# Altium schematic sheet 三川款阀控NB水表原理图_sch.schdoc: WX0.006.694DL
size A3; CompanyName: 浙江威星智能仪表股份有限公司; DocumentNumber: NB阀控水表; Revision: 1A; SheetNumber: 1; SheetTotal: 2; PageSetup: Record=PageOptions|CenterHorizontal=True|CenterVertical=True|PrintScale=0.90|XCorrection=1.00|YCorrection=1.00|PrintKind=0|BorderSize=5000000|LeftOffset=0|BottomOffset=0|Orientation=2|PaperLength=1000|PaperWidth=1000|Scale=100|PaperSource=7|PrintQuality=-3|MediaType=1|DitherType=10|PrintScaleMode=0|PaperKind=A3 (297 x 420 毫米)|PaperIndex=8
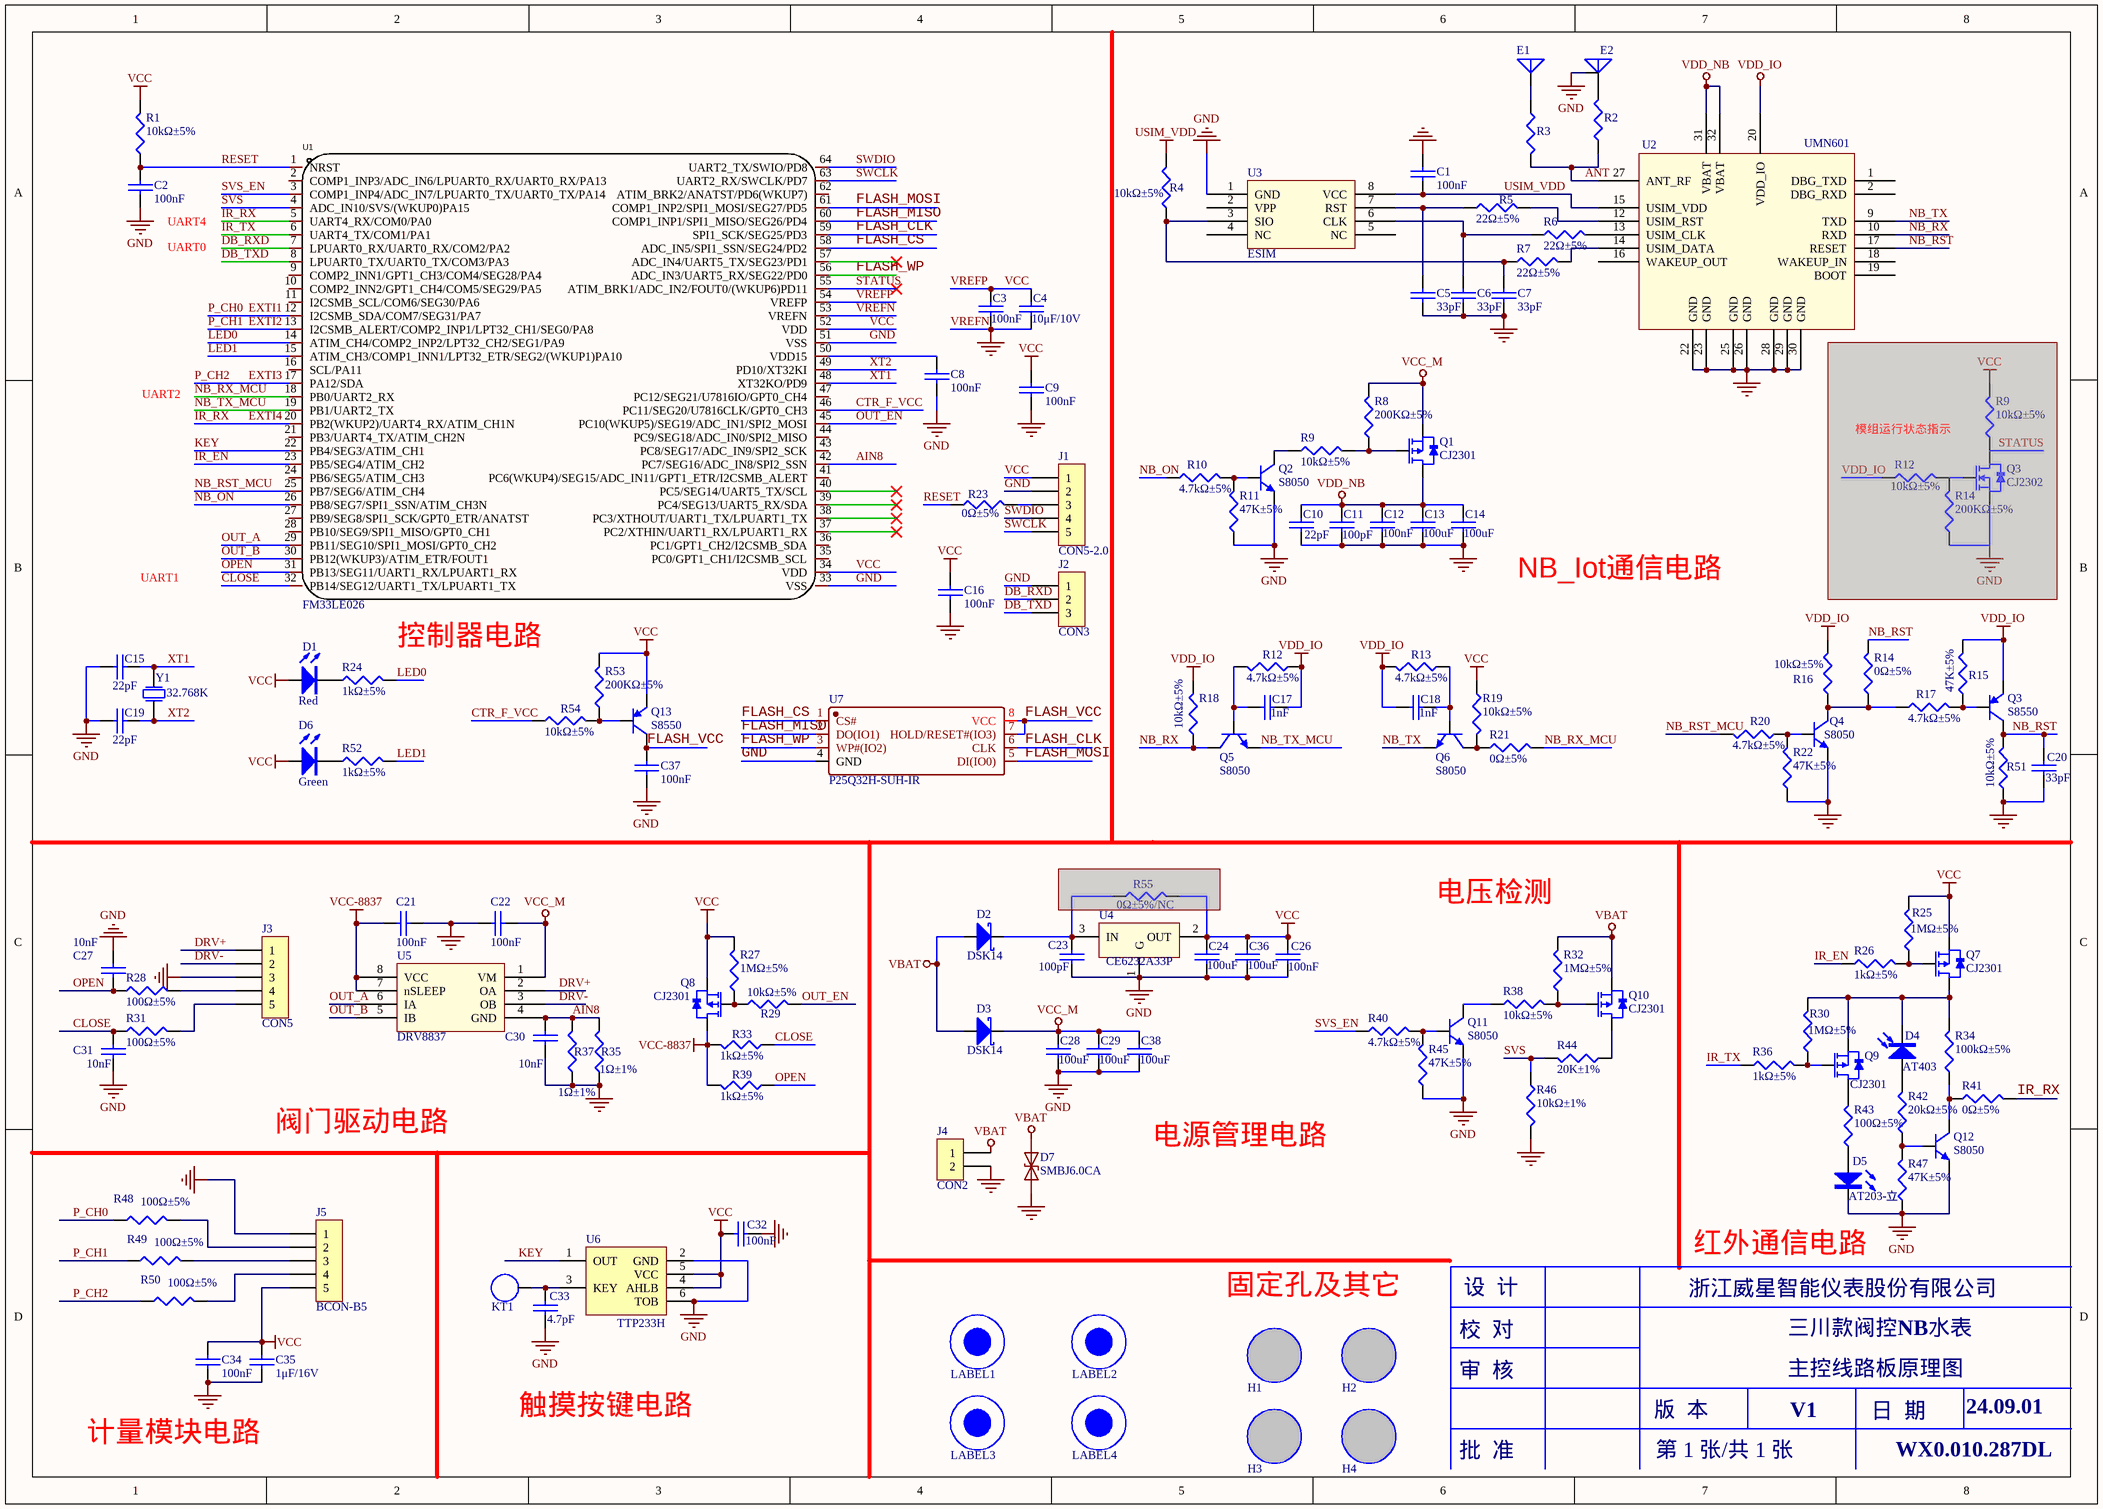
[diagram p0: 三川款阀控NB水表原理图_sch.schdoc]

## Parts
(Parts that share a designator on the sheet are numbered #1, #2 ... from top to bottom, then left to right.)
C1  100nF  [C0603]
C2  100nF  [C0603]
C3  100nF  [C0603]
C4  10μF/10V  [C0603]
C5  33pF  [C0603]
C6  33pF  [C0603]
C7  33pF  [C0603]
C8  100nF  [C0603]
C9  100nF  [C0603]
C10  22pF  [C0603]
C11  100pF  [C0603]
C12  100nF  [C0603]
C13  100uF  [C1206]
C14  100uF  [C1206]
C15  22pF  [C0603]
C16  100nF  [C0603]
C17  1nF  [C0603]
C18  1nF  [C0603]
C19  22pF  [C0603]
C20  33pF  [C0603]
C21  100nF  [C0603]
C22  100nF  [C0603]
C23  100pF  [C0603]
C24  100uF  [C1206]
C26  100nF  [C0603]
C27  10nF  [C0603]
C28  100uF  [C1206]
C29  100uF  [C1206]
C30  10nF  [C0603]
C31  10nF  [C0603]
C32  100nF  [C0603]
C33  4.7pF  [C0603]
C34  100nF  [C0603]
C35  1μF/16V  [C0603]
C36  100uF  [C1206]
C37  100nF  [C0603]
C38  100uF  [C1206]
D1  Red  [LED-0603]
D2  DSK14  [SOD-123]
D3  DSK14  [SOD-123]
D4  AT403  [LED-3]
D5  AT203-立  [LED-3]
D6  Green  [LED-0603]
D7  SMBJ6.0CA  [TVS-SMB]
E1  (no value)  [ANT-1]
E2  ANTENNA_3  [ANT-3]  (value not drawn)
H1  (no value)  [HOLE-2.5]  (no BOM)
H2  (no value)  [HOLE-2.5]  (no BOM)
H3  (no value)  [HOLE-2.5]  (no BOM)
H4  (no value)  [HOLE-2.5]  (no BOM)
J1  CON5-2.0  [J_DIP_2.0_1*05_H]  (no BOM)
J2  CON3  [SIP-3]  (no BOM)
J3  CON5  [SIP-5]  (no BOM)
J4  CON2  [SIP-2]  (no BOM)
J5  BCON-B5  [BCON-B5]  (no BOM)
KT1  Touch  [TOUCH-1]  (value not drawn)
LABEL1  (no value)  [MARK]  (no BOM)
LABEL2  (no value)  [MARK]  (no BOM)
LABEL3  (no value)  [MARK]  (no BOM)
LABEL4  (no value)  [MARK]  (no BOM)
Q1  CJ2301  [SOT-23]
Q2  S8050  [SOT-23]
Q3#1  CJ2302  [SOT-23]  (masked out: inside a compile mask, not in the netlist)
Q3#2  S8550  [SOT-23]
Q4  S8050  [SOT-23]
Q5  S8050  [SOT-23]
Q6  S8050  [SOT-23]
Q7  CJ2301  [SOT-23]
Q8  CJ2301  [SOT-23]
Q9  CJ2301  [SOT-23]
Q10  CJ2301  [SOT-23]
Q11  S8050  [SOT-23]
Q12  S8050  [SOT-23]
Q13  S8550  [SOT-23]
R1  10kΩ±5%  [R0603]
R2  0Ω±5%  [R0603]  (value not drawn)
R3  0Ω±5%  [R0603]  (value not drawn)
R4  10kΩ±5%  [R0603]
R5  22Ω±5%  [R0603]
R6  22Ω±5%  [R0603]
R7  22Ω±5%  [R0603]
R8  200KΩ±5%  [R0603]
R9#1  10kΩ±5%  [R0603]
R9#2  10kΩ±5%  [R0603]  (masked out: inside a compile mask, not in the netlist)
R10  4.7kΩ±5%  [R0603]
R11  47K±5%  [R0603]
R12#1  10kΩ±5%  [R0603]  (masked out: inside a compile mask, not in the netlist)
R12#2  4.7kΩ±5%  [R0603]
R13  4.7kΩ±5%  [R0603]
R14#1  200KΩ±5%  [R0603]  (masked out: inside a compile mask, not in the netlist)
R14#2  0Ω±5%  [R0603]
R15  47K±5%  [R0603]
R16  10kΩ±5%  [R0603]
R17  4.7kΩ±5%  [R0603]
R18  10kΩ±5%  [R0603]
R19  10kΩ±5%  [R0603]
R20  4.7kΩ±5%  [R0603]
R21  0Ω±5%  [R0603]
R22  47K±5%  [R0603]
R23  0Ω±5%  [R0603]
R24  1kΩ±5%  [R0603]
R25  1MΩ±5%  [R0603]
R26  1kΩ±5%  [R0603]
R27  1MΩ±5%  [R0603]
R28  100Ω±5%  [R0603]
R29  10kΩ±5%  [R0603]
R30  1MΩ±5%  [R0603]
R31  100Ω±5%  [R0603]
R32  1MΩ±5%  [R0603]
R33  1kΩ±5%  [R0603]
R34  100kΩ±5%  [R0603]
R35  1Ω±1%  [R1206]
R36  1kΩ±5%  [R0603]
R37  1Ω±1%  [R1206]
R38  10kΩ±5%  [R0603]
R39  1kΩ±5%  [R0603]
R40  4.7kΩ±5%  [R0603]
R41  0Ω±5%  [R0603]
R42  20kΩ±5%  [R0603]
R43  100Ω±5%  [R0603]
R44  20K±1%  [R0603]
R45  47K±5%  [R0603]
R46  10kΩ±1%  [R0603]
R47  47K±5%  [R0603]
R48  100Ω±5%  [R0603]
R49  100Ω±5%  [R0603]
R50  100Ω±5%  [R0603]
R51  10kΩ±5%  [R0603]
R52  1kΩ±5%  [R0603]
R53  200KΩ±5%  [R0603]
R54  10kΩ±5%  [R0603]
R55  0Ω±5%/NC  [R0603]  (masked out: inside a compile mask, not in the netlist)
U1  FM33LE026  [LQFP-64_L10.0-W10.0-P0.50-LS12.0-BL]
U2  UMN601  [MB26-Y0B]
U3  ESIM  [MFF2]
U4  CE6232A33P  [SOT89]
U5  DRV8837  [WSON-8]
U6  TTP233H  [SOT-23-6]
U7  P25Q32H-SUH-IR  [SOIC-8]
Y1  32.768K  [Y3215]

## Nets
GND: C1.1 C2.1 C3.1 C4.1 C5.1 C6.1 C7.2 C8.1 C9.1 C10.1 C11.1 C12.1 C13.1 C14.1 C15.1 C16.1 C19.1 C20.1 C21.1 C22.2 C23.1 C24.1 C26.1 C27.2 C28.1 C29.1 C30.1 C31.1 C32.2 C33.1 C34.1 C35.1 C36.1 C37.1 C38.1 D5.2(K) D7.2(A1) E2.2 J1.2 J2.1 J3.3 J4.2 J5.1 Q2.2(E) Q4.2(E) Q11.2(E) Q12.2(E) R11.1 R22.1 R35.1 R37.1 R45.1 R46.2 R47.1 R51.1 U1.33(VSS) U1.51(VSS) U1.53(VREFN) U2.22(GND) U2.23(GND) U2.25(GND) U2.26(GND) U2.28(GND) U2.29(GND) U2.30(GND) U3.1(GND) U4.1(G) U5.0(GND) U6.2(GND) U6.6(TOB) U7.4(GND)  [also labelled VREFN]
USIM_VDD: C1.2 R4.2 U2.15(USIM_VDD) U3.8(VCC)
VBAT: D2.1(A) D3.1(A) D7.1(A2) J4.1 Q10.2(S) R32.2
VCC: C3.2 C4.2 C9.2 C16.2 C24.2 C26.2 C32.1 C34.2 C35.2 C36.2 D1.1(A) D6.1(A) J1.1 J5.5 Q7.2(S) Q8.2(S) Q13.2(E) R1.2 R19.1 R25.2 R27.2 R53.2 U1.34(VDD) U1.52(VDD) U1.54(VREFP) U4.2(OUT) U6.4(AHLB) U6.5(VCC)  [also labelled VREFP]
VCC-8837: C21.2 Q8.3(D) R33.2 R39.2 U5.7(nSLEEP) U5.8(VCC)
VCC_M: C22.1 C28.2 C29.2 C38.2 D3.2(K) Q1.2(S) R8.2 U5.1(VM)
VDD_IO: C17.2 C18.1 Q3#2.2(E) R12#2.1 R13.2 R15.2 R16.2 R18.2 U2.20(VDD_IO)
VDD_NB: C10.2 C11.2 C12.2 C13.2 C14.2 Q1.3(D) U2.31(VBAT) U2.32(VBAT)
AIN8: C30.2 R35.2 R37.2 U1.42(PC7/SEG16/ADC_IN8/SPI2_SSN) U5.4(GND)
ANT: R2.1 R3.2 U2.27(ANT_RF)
CLOSE: C31.2 R31.1 R33.1 U1.32(PB14/SEG12/UART1_TX/LPUART1_TX)
CTR_F_VCC: R54.1 U1.46(PC11/SEG20/U7816CLK/GPT0_CH3)
DB_RXD: J2.2 U1.7(LPUART0_RX/UART0_RX/COM2/PA2)
DB_TXD: J2.3 U1.8(LPUART0_TX/UART0_TX/COM3/PA3)
DRV+: J3.1 U5.2(OA)
DRV-: J3.2 U5.3(OB)
EXTI1: R48.1 U1.12(I2CSMB_SDA/COM7/SEG31/PA7)  [also labelled P_CH0]
EXTI2: R49.1 U1.13(I2CSMB_ALERT/COMP2_INP1/LPT32_CH1/SEG0/PA8)  [also labelled P_CH1]
EXTI3: R50.1 U1.17(PA12/SDA)  [also labelled P_CH2]
EXTI4: R41.2 U1.5(UART4_RX/COM0/PA0) U1.20(PB2(WKUP2)/UART4_RX/ATIM_CH1N)  [also labelled IR_RX]
FLASH_CLK: U1.59(SPI1_SCK/SEG25/PD3) U7.6(CLK)
FLASH_CS: U1.58(ADC_IN5/SPI1_SSN/SEG24/PD2) U7.1(CS#)
FLASH_MISO: U1.60(COMP1_INP1/SPI1_MISO/SEG26/PD4) U7.2(DO(IO1))
FLASH_MOSI: U1.61(COMP1_INP2/SPI1_MOSI/SEG27/PD5) U7.5(DI(IO0))
FLASH_VCC: C37.2 Q13.3(C) U7.7(HOLD/RESET#(IO3)) U7.8(VCC)
FLASH_WP: U1.56(ADC_IN3/UART5_RX/SEG22/PD0) U7.3(WP#(IO2))
IR_EN: R26.1 U1.23(PB5/SEG4/ATIM_CH2)
IR_TX: R36.1 U1.6(UART4_TX/COM1/PA1)
KEY: U1.22(PB4/SEG3/ATIM_CH1) U6.1(OUT)
LED0: R24.2 U1.14(ATIM_CH4/COMP2_INP2/LPT32_CH2/SEG1/PA9)
LED1: R52.2 U1.15(ATIM_CH3/COMP1_INN1/LPT32_ETR/SEG2/(WKUP1)PA10)
NB_ON: R10.1 U1.26(PB8/SEG7/SPI1_SSN/ATIM_CH3N)
NB_RST: C20.2 Q3#2.3(C) R14#2.2 R51.2 U2.17(RESET)
NB_RST_MCU: R20.2 U1.25(PB7/SEG6/ATIM_CH4)
NB_RX: Q5.3(C) R18.1 U2.10(RXD)
NB_RX_MCU: R21.2 U1.18(PB0/UART2_RX)
NB_TX: Q6.2(E) U2.9(TXD)
NB_TX_MCU: Q5.2(E) U1.19(PB1/UART2_TX)
OPEN: C27.1 R28.1 R39.1 U1.31(PB13/SEG11/UART1_RX/LPUART1_RX)
OUT_A: U1.29(PB11/SEG10/SPI1_MOSI/GPT0_CH2) U5.6(IA)
OUT_B: U1.30(PB12(WKUP3)/ATIM_ETR/FOUT1) U5.5(IB)
OUT_EN: R29.2 U1.45(PC10(WKUP5)/SEG19/ADC_IN1/SPI2_MOSI)
RESET: C2.2 R1.1 R23.1 U1.1(NRST)
STATUS: U1.55(ATIM_BRK1/ADC_IN2/FOUT0/(WKUP6)PD11)
SVS: R44.2 R46.1 U1.4(ADC_IN10/SVS/(WKUP0)PA15)
SVS_EN: R40.1 U1.3(COMP1_INP4/ADC_IN7/LPUART0_TX/UART0_TX/PA14)
SWCLK: J1.5 U1.63(UART2_RX/SWCLK/PD7)
SWDIO: J1.4 U1.64(UART2_TX/SWIO/PD8)
XT1: C15.2 U1.48(XT32KO/PD9) Y1.2(P2)
XT2: C19.2 U1.49(PD10/XT32KI) Y1.1(P1)
NetC5_2: C5.2 R5.1 U3.7(RST)
NetC6_2: C6.2 R6.1 U3.6(CLK)
NetC7_1: C7.1 R4.1 R7.1 U3.3(SIO)
NetC8_2: C8.2 U1.50(VDD15)
NetC17_1: C17.1 Q5.1(B) R12#2.2
NetC18_2: C18.2 Q6.1(B) R13.1
NetC23_2: C23.2 D2.2(K) U4.3(IN)
NetC33_2: C33.2 KT1.1 U6.3(KEY)
NetD1_2: D1.2(K) R24.1
NetD4_1: D4.1(A) R42.2
NetD4_2: D4.2(K) Q7.3(D) Q9.2(S) R30.2 R34.2
NetD5_1: D5.1(A) R43.1
NetD6_2: D6.2(K) R52.1
NetE1_1: E1.1(A) R3.1
NetE2_1: E2.1(A) R2.2
NetJ1_3: J1.3 R23.2
NetJ3_4: J3.4 R28.2
NetJ3_5: J3.5 R31.2
NetJ5_2: J5.2 R48.2
NetJ5_3: J5.3 R49.2
NetJ5_4: J5.4 R50.2
NetQ1_1: Q1.1(G) R8.1 R9#1.2
NetQ2_1: Q2.1(B) R10.2 R11.2
NetQ2_3: Q2.3(C) R9#1.1
NetQ3#2_1: Q3#2.1(B) R15.1 R17.2
NetQ4_1: Q4.1(B) R20.1 R22.2
NetQ4_3: Q4.3(C) R14#2.1 R16.1 R17.1
NetQ6_3: Q6.3(C) R19.2 R21.1
NetQ7_1: Q7.1(G) R25.1 R26.2
NetQ8_1: Q8.1(G) R27.1 R29.1
NetQ9_1: Q9.1(G) R30.1 R36.2
NetQ9_3: Q9.3(D) R43.2
NetQ10_1: Q10.1(G) R32.1 R38.2
NetQ10_3: Q10.3(D) R44.1
NetQ11_1: Q11.1(B) R40.2 R45.2
NetQ11_3: Q11.3(C) R38.1
NetQ12_1: Q12.1(B) R42.1 R47.2
NetQ12_3: Q12.3(C) R34.1 R41.1
NetQ13_1: Q13.1(B) R53.1 R54.2
NetR5_2: R5.2 U2.12(USIM_RST)
NetR6_2: R6.2 U2.13(USIM_CLK)
NetR7_2: R7.2 U2.14(USIM_DATA)

Not connected (* = marked no-connect by the designer): U1 2(COMP1_INP3/ADC_IN6/LPUART0_RX/UART0_RX/PA13) 9(COMP2_INN1/GPT1_CH3/COM4/SEG28/PA4) 10(COMP2_INN2/GPT1_CH4/COM5/SEG29/PA5) 11(I2CSMB_SCL/COM6/SEG30/PA6) 16(SCL/PA11) 21(PB3/UART4_TX/ATIM_CH2N) 24(PB6/SEG5/ATIM_CH3) 27(PB9/SEG8/SPI1_SCK/GPT0_ETR/ANATST) 28(PB10/SEG9/SPI1_MISO/GPT0_CH1) 35(PC0/GPT1_CH1/I2CSMB_SCL) 36(PC1/GPT1_CH2/I2CSMB_SDA) 37(PC2/XTHIN/UART1_RX/LPUART1_RX)* 38(PC3/XTHOUT/UART1_TX/LPUART1_TX)* 39(PC4/SEG13/UART5_RX/SDA)* 40(PC5/SEG14/UART5_TX/SCL)* 41(PC6(WKUP4)/SEG15/ADC_IN11/GPT1_ETR/I2CSMB_ALERT) 43(PC8/SEG17/ADC_IN9/SPI2_SCK) 44(PC9/SEG18/ADC_IN0/SPI2_MISO) 47(PC12/SEG21/U7816IO/GPT0_CH4) 57(ADC_IN4/UART5_TX/SEG23/PD1)* 62(ATIM_BRK2/ANATST/PD6(WKUP7)); U2 1(DBG_TXD) 2(DBG_RXD) 16(WAKEUP_OUT) 18(WAKEUP_IN) 19(BOOT); U3 2(VPP) 4(NC) 5(NC)

## Notes on the sheet
- (near C2) UART4
- UART0
- UART2
- (near R12#1) 模组运行状态指示
- UART1
- NB_Iot通信电路
- 控制器电路
- 电压检测
- 阀门驱动电路
- 电源管理电路
- 红外通信电路
- 固定孔及其它
- 设  计
- 浙江威星智能仪表股份有限公司
- 审  核
- 校  对
- 三川款阀控NB水表
- 主控线路板原理图
- 计量模块电路
- 触摸按键电路
- 批  准
- 版  本
- 第 1 张/共 1 张
- V1
- 日  期
- WX0.010.287DL
- 24.09.01
- 校 对
- 设 计
- 审 核
- PROJECT :
- 标准化
- 工 艺
- Size
- A3
- Docment Number
- Revision
- File
- Date
- Sheet
- of

## Library data of the parts
C1-C3 C8 C9 C12 C16 C21 C22 C26 C32 C34 C37 = 1: 贴片电容,100nF±10%/50V,X7R,国巨; Part Number: 101020103-0021; Manufacturer P/N: CC0603KRX7R9BB104; ID: 1; Part Name: 贴片电容; Manufacturer: 国巨
C4 = 8: 贴片电容,10μF±10%/10V,X7R,村田; Part Number: 101020103-0026; Manufacturer P/N: GRM188R61A106KE47D; ID: 8; Part Name: 贴片电容; Manufacturer: 村田
C5-C7 C20 = 4: 贴片电容,33pF±10%/50V,NP0,国巨; Part Number: 101020103-0027; Manufacturer P/N: CC0603KRNPO9BN33; ID: 4; Part Name: 贴片电容; Manufacturer: 国巨
C10 C15 C19 = 3: 贴片电容,22pF±5%/50V,NP0,国巨; Part Number: 101020103-0009; Manufacturer P/N: CC0603JRNPO9BN22; ID: 3; Part Name: 贴片电容; Manufacturer: 国巨
C11 C23 = 9: 贴片电容,100pF±10%/50V,NP0,国巨; Part Number: 101020103-0010; Manufacturer P/N: CC0603JRNPO9BN101; ID: 9; Part Name: 贴片电容; Manufacturer: 国巨
C13 C14 C24 C28 C29 C36 C38 = 16: 贴片电容,100uF±20%/6.3V,X5R,村田; Part Number: 101020101-0020; Manufacturer P/N: GRM31CR60J107ME39L; ID: 16; Part Name: 贴片电容; Manufacturer: 村田
C17 C18 = 6: 贴片电容,1nF±10%/50V,X7R,国巨; Part Number: 101020103-0022; Manufacturer P/N: CC0603KRX7R9BB102; ID: 6; Part Name: 贴片电容; Manufacturer: 国巨
C27 C30 C31 = 5: 贴片电容,10nF±10%/50V,X7R,国巨; Part Number: 101020103-0007; Manufacturer P/N: CC0603KRX7R9BB103; ID: 5; Part Name: 贴片电容; Manufacturer: 国巨
C33 = 18: 贴片电容,4.7pF±0.25pF/50V,NPO,国巨; Part Number: 101020103-0040; Manufacturer P/N: CC0603CRNP09BN4R7; ID: 18; Part Name: 贴片电容; Manufacturer: 国巨
C35 = 2: 贴片电容,1μF±10%/16V,X7R,国巨; Part Number: 101020103-0003; Manufacturer P/N: CC0603KRX7R7BB105; ID: 2; Part Name: 贴片电容; Manufacturer: 国巨
D1 = 3: 发光二极管,红色,0603,光宝; Part Number: 101040102-0006; ID: 3; Part Name: 发光二极管; Manufacturer: 光宝
D2 D3 = 8: DSK14,SOD-123FL,1 A,40 V,28 V,台湾强茂集团苏州群鑫电子,DSK14; Part Number: 101040101-0043; Part Name: 贴片二极管; ID: 8; Manufacturer: 台湾强茂集团苏州群鑫电子
D4 = 6: 红外接收头，插件，红光，AT403_PD_01; Part Number: 101040102-0011; Part Name: 红外接收管; Manufacturer: 品观; ID: 6; SMD/DIP: DIP
D5 = 5: 红外发射头，插件，红光，AT203; Part Number: 101040102-0010; Part Name: 红外发射管; Manufacturer: 品观; ID: 5
D6 = 5: 发光二极管,绿色,亿光，19-217/GHC-YR1S2/3T; Part Number: 101040102-0018; Part Name: 贴片发光二极管; Manufacturer: 亿光; ID: 5; Manufacturer P/N: 19-217/GHC-YR1S2/3T
D7 = 7: 双向贴片TVS管，SMBJ6.0CA_C211762，SMB,杨杰; Part Number: 101040101-0024; Part Name: 贴片TVS管; Manufacturer: 扬州杨杰; ID: 7; Manufacturer P/N: SMBJ6.0CA_C211762
E1 = 1: 天线,5mm弹簧,电信; Part Number: 1020599-0244; ID: 1; Part Name: 天线
E2 = 28: 外置天线焊盘（固定孔）; Part Name: 虚拟器件; ID: 28; Part Number: *
H1-H4 = 22: 定位孔,孔径2.5mm,非金属化,无电气连接; Part Name: 虚拟器件; ID: 22; Part Number: *
J1 = 15: 焊接插座,间距2.0mm; Part Name: 焊接插件; ID: 15
J2 = 2: 焊接插座,间距2.54mm; ID: 2; Part Number: *; Part Name: 焊接插座
J3 = 4: 焊接插座,间距2.54mm; ID: 4; Part Number: *; Part Name: 焊接插座
J4 = 1: 焊接插座,间距2.54mm; ID: 1; Part Number: *; Part Name: 焊接插座
J5 = 9: 焊接插座,90度插板双面焊盘,母头,间距1.5mm; Part Number: 21001-0002; ID: 9; Part Name: 焊接插座
KT1 = 2: 按键,6mm弹簧按键,按键直径10mm; Part Number: 1011001-0060; ID: 2; Part Name: 按键
LABEL1-LABEL4 = 1: 标准Mark点,直径1mm,阻焊开窗3mm; Part Name: 虚拟器件; ID: 1; Part Number: *
Q1 Q7-Q10 = 2: 贴片MOS管,PMOS,CJ2301,江苏长电; Part Number: 101040201-0019; ID: 2; Part Name: 贴片MOS管; Manufacturer: 江苏长电
Q2 Q4-Q6 Q11 Q12 = 1: 贴片三极管,NPN,S8050(L),江苏长电; Part Number: 101040201-0003; ID: 1; Part Name: 贴片三极管; Manufacturer: 江苏长电
Q3#1 = 1: 贴片MOS管,NMOS,CJ2302,江苏长电; Part Number: 101040201-0020; ID: 1; Part Name: 贴片MOS管; Manufacturer: 江苏长电
Q3#2 Q13 = 2: 贴片三极管,PNP,S8550(L),江苏长电; Part Number: 101040201-0004; ID: 2; Part Name: 贴片三极管; Manufacturer: 江苏长电
R1 R4 R9#1 R9#2 R12#1 R16 R18 R19 R29 R38 R51 R54 = 2: 贴片电阻,10kΩ±5%,1/10W,100ppm/℃,国巨; Part Number: 101010103-0003; Manufacturer P/N: RC0603JR-0710KL; ID: 2; Part Name: 贴片电阻; Manufacturer: 国巨
R2 R3 R14#2 R21 R23 R41 R55 = 15: 贴片电阻,0Ω±5%,1/10W,100ppm/℃,国巨; Part Number: 101010103-0001; Manufacturer P/N: RC0603JR-070RL; ID: 15; Part Name: 贴片电阻; Manufacturer: 国巨
R5-R7 = 14: 贴片电阻,22Ω±5%,1/10W,100ppm/℃,国巨; Part Number: 101010103-0009; Manufacturer P/N: RC0603JR-0722RL; ID: 14; Part Name: 贴片电阻; Manufacturer: 国巨
R8 R14#1 R53 = 16: 贴片电阻,200kΩ±5%,200mW,100ppm/℃,国巨; Part Number: 101010103-0034; Manufacturer P/N: RC0603JR-07200KL; ID: 16; Part Name: 贴片电阻; Manufacturer: 国巨
R10 R12#2 R13 R17 R20 R40 = 12: 贴片电阻,4.7kΩ±5%,1/10W,100ppm/℃,国巨; Part Number: 101010103-0042; Manufacturer P/N: RC0603JR-074K7L; ID: 12; Part Name: 贴片电阻; Manufacturer: 国巨
R11 R15 R22 R45 R47 = 22: 贴片电阻，47K,±5%,1/10W,0603,国巨,RC0603JR-0747KL; Part Number: 101010103-0012; Part Name: 贴片电阻; ID: 22; Manufacturer: 国巨; Manufacturer P/N: RC0603JR-0747KL
R24 R26 R33 R36 R39 R52 = 1: 贴片电阻,1kΩ±5%,1/10W,100ppm/℃,国巨; Part Number: 101010103-0008; Manufacturer P/N: RC0603JR-071KL; ID: 1; Part Name: 贴片电阻; Manufacturer: 国巨
R25 R27 R30 R32 = 4: 贴片电阻,1MΩ±5%,1/10W,100ppm/℃,国巨; Part Number: 101010103-0002; Manufacturer P/N: RC0603JR-071ML; ID: 4; Part Name: 贴片电阻; Manufacturer: 国巨
R28 R31 R43 R48-R50 = 5: 贴片电阻,100Ω±5%,1/10W,100ppm/℃,国巨; Part Number: 101010103-0022; Manufacturer P/N: RC0603JR-07100RL; ID: 5; Part Name: 贴片电阻; Manufacturer: 国巨
R34 = 3: 贴片电阻,100kΩ±5%,1/10W,100ppm/℃,国巨; Part Number: 101010103-0005; Manufacturer P/N: RC0603JR-07100KL; ID: 3; Part Name: 贴片电阻; Manufacturer: 国巨
R35 R37 = 41: 贴片电阻，1Ω±1%,1/4W,1206,国巨,RC1206FR-071RL; Part Number: 101010101-0034; Part Name: 贴片电阻; ID: 41; Manufacturer: 国巨; Manufacturer P/N: RC1206FR-071RL
R42 = 7: 贴片电阻,20kΩ±5%,1/10W,100ppm/℃,国巨; Part Number: 101010103-0004; Manufacturer P/N: RC0603FR-0720KL; ID: 7; Part Name: 贴片电阻; Manufacturer: 国巨
R44 = 23: 贴片电阻，20K,±1%,1/10W,0603,国巨,RC0603FR-0720KL; Part Number: 101010103-0048; Part Name: 贴片电阻; ID: 23; Manufacturer: 国巨; Manufacturer P/N: RC0603FR-0720KL
R46 = 6: 贴片电阻,10kΩ±1%,1/10W,100ppm/℃,国巨; Part Number: 101010103-0052; Manufacturer P/N: RC0603FR-0710KL; ID: 6; Part Name: 贴片电阻; Manufacturer: 国巨
U1 = 10: 单片机,FM33LE026,复旦微; Part Name: 集成电路; Part Number: 101050101-0352; Symbol: FM33LC026N; Add into BOM: yes; CPU Core: CM0; Program Storage Size: 128KB; RAM Size: 24KB; GPIO Ports Number: 54; Operating Voltage Range: 1.8V~5.5V; CPU Maximum Speed: 64MHz; Program Memory Type: FLASH; ADC (Bit): 12bit; 16Bit Timer: 3; 32Bit Timer: 2; UART/USART: 6; I2C: 1; Internal Comparator: ��; Peripheral/Function: Ƭ���¶ȴ����������Ź����͵�ѹ��⣻Ӳ�������㷨���棻PWM��CCP����/�Ƚϣ�LCD/LED���������������������RTCʵʱʱ��; ID: 10; Device: FM33LC026N; Supplier: LCSC; Supplier Part: C648829; Manufacturer: 复旦微; Manufacturer Part: FM33LC026N; JLCPCB Part Class: Extended Part; LCSC Part Name: LC0ϵ�е͹���; Supplier Footprint: LQFP-64(10x10); Datasheet: https://atta.szlcsc.com/upload/public/pdf/source/20200616/C648829_514A77D3BF4E1F83D99F50A2DA443E89.pdf; Convert to PCB: yes; Operating Temperature Range: -40��~+85��; DAC (Bit): -; PWM (Bit): -; SPI: 2; Universal Serial Bus: -; communication protocol: -; Watchdog: ��; Real-Time Clock: ��; Infrared Data Association: -; Low-Voltage Detect: ��; CCP Capture/Compare: ��; Secure Digital Input and Output: -; Direct Memory Access: -; Internal Oscillator: ��
U2 = 3: 集成电路,MB26-Y0B,利尔达; Part Number: 1011402-0246; ID: 3; Part Name: 集成电路; Manufacturer: 利尔达
U3 = 2: 集成电路,ESIM,杭州电信; Part Number: 101050101-0120; Manufacturer: 电信; ID: 2; Part Name: 集成电路
U4 = 6: 集成电路，CE6232A33P,SOT89; Part Name: 集成电路; Part Number: 1010503-0029; ID: 6; Manufacturer: CE6232A33P; Manufacturer P/N: CE6232A33P
U5 = 2: 集成电路,DRV8837DSGR,TI; Part Number: 101050101-0060; ID: 2; Part Name: 集成电路; Manufacturer: TI; Manufacturer P/N: DRV8837DSGR
U6 = 5: 集成电路，TTP233H,TONTEK; Part Number: 101050101-0262; Part Name: 集成电路; Manufacturer P/N: TTP233H-HA6; ID: 5; Manufacturer: TONTEK
U7 = 10: 集成电路，P25Q32H-SUH-IR，SOP-8,普冉半导体（上海）; Part Number: 101050101-0219; Part Name: 集成电路; ID: 10; Manufacturer: 普冉半导体（上海）
Y1 = 2: 晶振,32.768KHz,±20ppm,12.5pF,3215,EPSON; Part Number: 1010601-0009; ID: 2; Part Name: 晶振; Manufacturer: EPSON